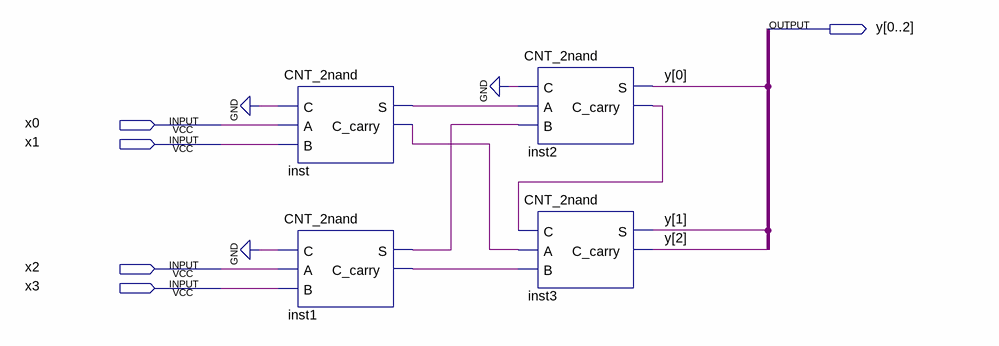
[diagram p0: schematic sheet]
// Quartus schematic Summation_of_units_4digit.bdf as structural Verilog: 4 symbols, 5 pins
module Summation_of_units_4digit (
  input  x0,
  input  x1,
  input  x2,
  input  x3,
  output [0:2] y
);

  wire inst1_c_carry, inst1_s, inst2_c_carry, inst_c_carry, inst_s;

  CNT_2nand inst (.C(1'b0), .A(x0), .B(x1), .S(inst_s), .C_carry(inst_c_carry));
  CNT_2nand inst1 (.C(1'b0), .A(x2), .B(x3), .S(inst1_s), .C_carry(inst1_c_carry));
  CNT_2nand inst2 (.C(1'b0), .A(inst_s), .B(inst1_s), .S(y[0]), .C_carry(inst2_c_carry));
  CNT_2nand inst3 (.C(inst2_c_carry), .A(inst_c_carry), .B(inst1_c_carry), .S(y[1]), .C_carry(y[2]));
endmodule
